# EAGLE design S4CX11 (EAGLE 7.5.0)
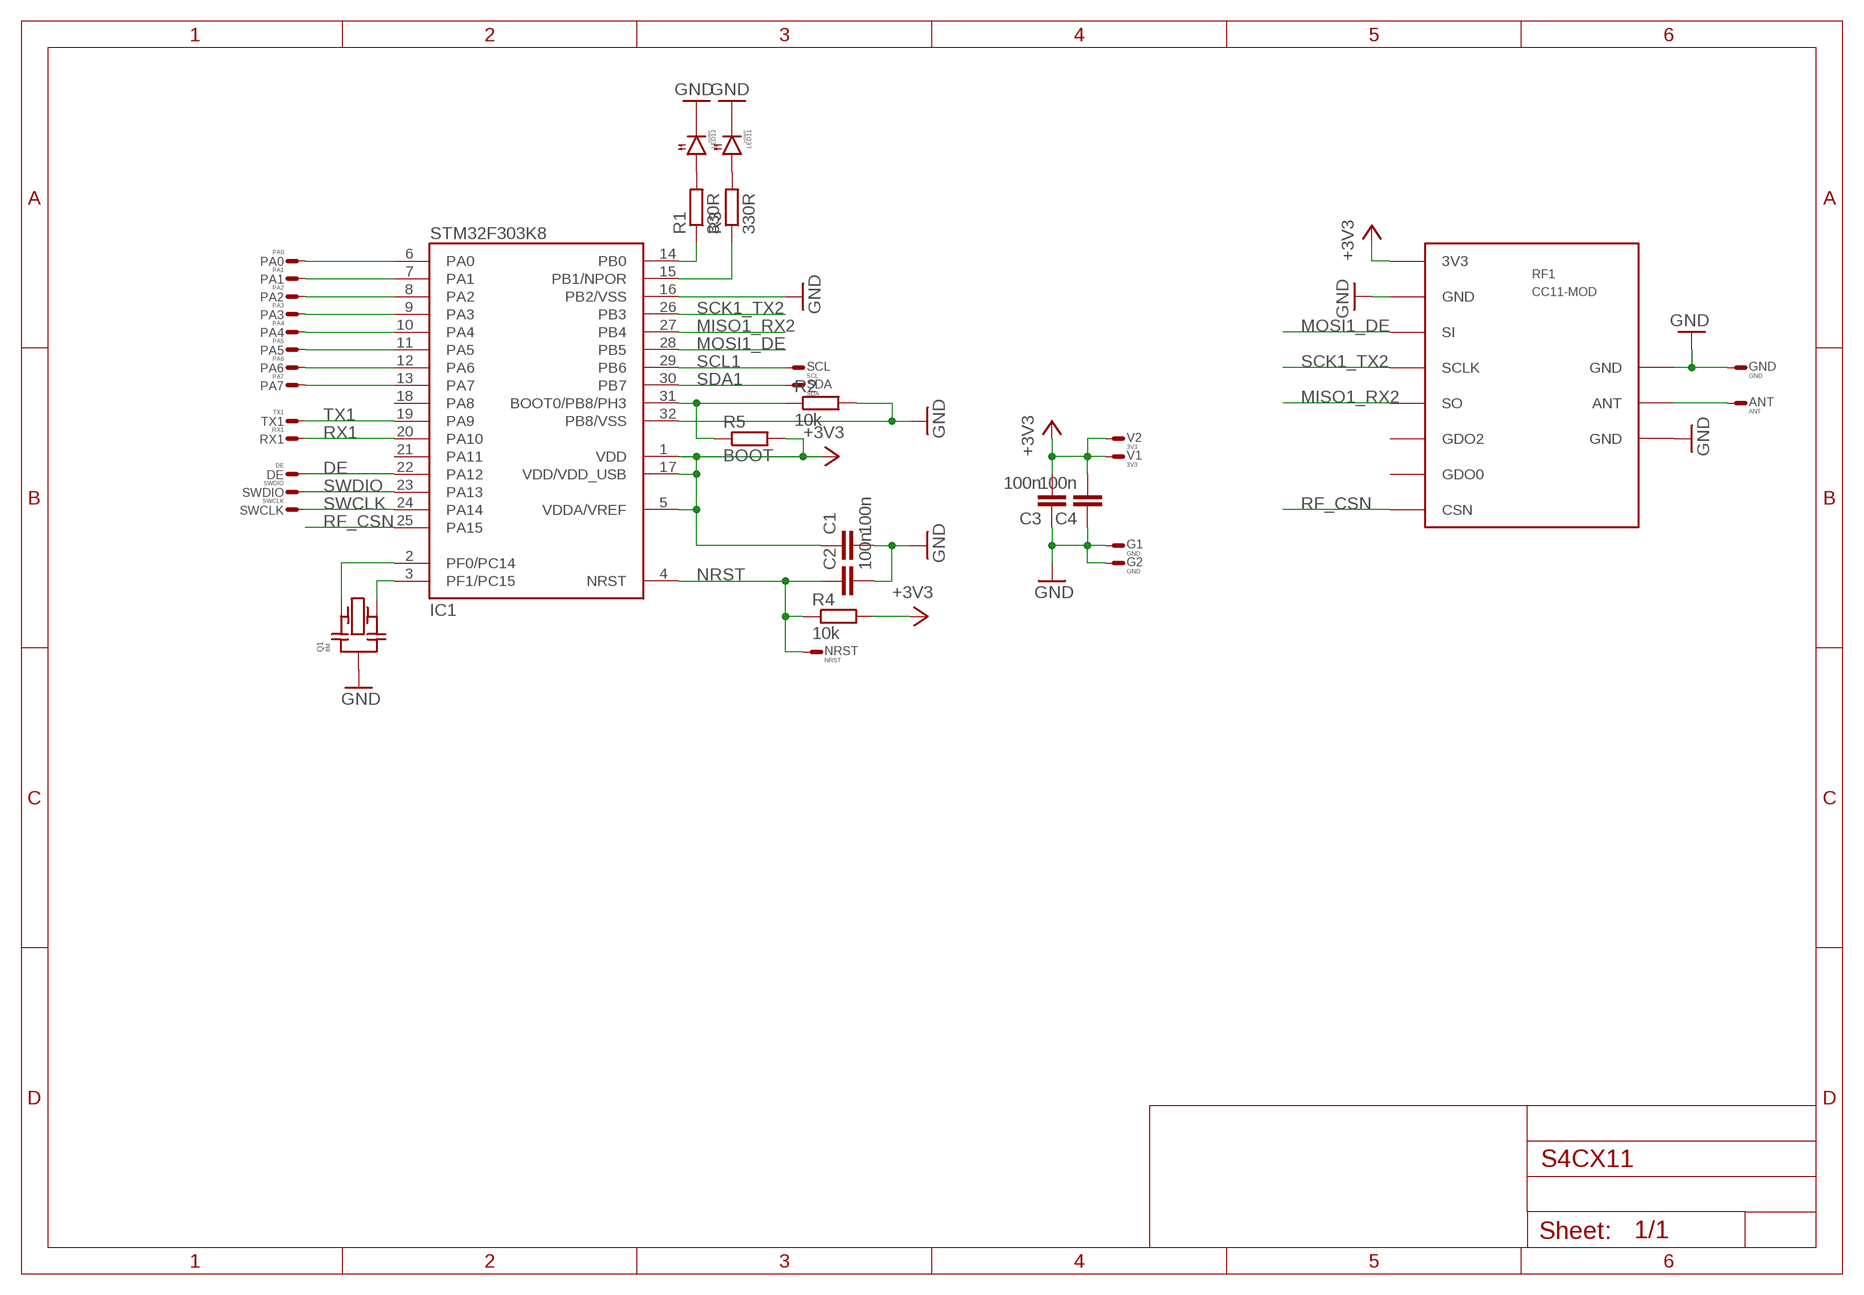
[diagram p0: schematic, sheet 1]

## Parts
ANT  ANT  WIREPADT1.6/0.9  [T1.6/0.9]
C1  100n  C0603  [0603]
C2  100n  C0603  [0603]
C3  100n  C0603  [0603]
C4  100n  C0603  [0603]
DE  DE  WIREPADT1.6/0.9  [T1.6/0.9]
G1  GND  WIREPADT1.6/0.9  [T1.6/0.9]
G2  GND  WIREPADT1.6/0.9  [T1.6/0.9]
GND  GND  WIREPADT1.6/0.9  [T1.6/0.9]
IC1  STM32F303K8  STM32_LQFP32  [LQFP32-7X7]
LED1  HSMF  2LEDH  [HSMF]
NRST  NRST  WIREPADT1.6/0.9  [T1.6/0.9]
PA0  PA0  WIREPADT1.6/0.9  [T1.6/0.9]
PA1  PA1  WIREPADT1.6/0.9  [T1.6/0.9]
PA2  PA2  WIREPADT1.6/0.9  [T1.6/0.9]
PA3  PA3  WIREPADT1.6/0.9  [T1.6/0.9]
PA4  PA4  WIREPADT1.6/0.9  [T1.6/0.9]
PA5  PA5  WIREPADT1.6/0.9  [T1.6/0.9]
PA6  PA6  WIREPADT1.6/0.9  [T1.6/0.9]
PA7  PA7  WIREPADT1.6/0.9  [T1.6/0.9]
Q1  8M  QRCE  [CSTCE]
R1  330R  R0603  [0603]
R2  10k  R0603  [0603]
R3  330R  R0603  [0603]
R4  10k  R0603  [0603]
R5  BOOT  R1206  [1206]
RF1  CC11-MOD  [CC11-MOD]
RX1  RX1  WIREPADT1.6/0.9  [T1.6/0.9]
SCL  SCL  WIREPADT1.6/0.9  [T1.6/0.9]
SDA  SDA  WIREPADT1.6/0.9  [T1.6/0.9]
SWCLK  SWCLK  WIREPADT1.6/0.9  [T1.6/0.9]
SWDIO  SWDIO  WIREPADT1.6/0.9  [T1.6/0.9]
TX1  TX1  WIREPADT1.6/0.9  [T1.6/0.9]
V1  3V3  WIREPADT1.6/0.9  [T1.6/0.9]
V2  3V3  WIREPADT1.6/0.9  [T1.6/0.9]

## Nets
+3V3: C1.1 C3.2 C4.2 IC1.1(VDD) IC1.5(VDDA/VREF) IC1.17(VDD/VDD_USB) R4.2 R5.2 RF1.3V3 V1.1(S) V2.1(S)
DE: DE.1(S) IC1.22(PA12)
GND: C1.2 C2.2 C3.1 C4.1 G1.1(S) G2.1(S) GND.1(S) IC1.16(PB2/VSS) IC1.32(PB8/VSS) LED1.2(1:C) LED1.4(2:C) Q1.G(M) R2.2 RF1.GND@1(GND) RF1.GND@2(GND) RF1.GND@3(GND)
MISO1_RX2: IC1.27(PB4) RF1.SO
MOSI1_DE: IC1.28(PB5) RF1.SI
N$1: ANT.1(S) RF1.ANT
N$2: IC1.3(PF1/PC15) Q1.B
N$3: IC1.6(PA0) PA0.1(S)
N$4: IC1.31(BOOT0/PB8/PH3) R2.1 R5.1
N$5: IC1.2(PF0/PC14) Q1.A
N$6: IC1.7(PA1) PA1.1(S)
N$7: IC1.8(PA2) PA2.1(S)
N$8: IC1.9(PA3) PA3.1(S)
N$9: IC1.10(PA4) PA4.1(S)
N$10: IC1.11(PA5) PA5.1(S)
N$11: IC1.12(PA6) PA6.1(S)
N$12: IC1.13(PA7) PA7.1(S)
N$13: IC1.14(PB0) R1.1
N$14: IC1.15(PB1/NPOR) R3.1
N$17: LED1.1(1:A) R3.2
N$18: LED1.3(2:A) R1.2
NRST: C2.1 IC1.4(NRST) NRST.1(S) R4.1
RF_CSN: IC1.25(PA15) RF1.CSN
RX1: IC1.20(PA10) RX1.1(S)
SCK1_TX2: IC1.26(PB3) RF1.SCLK
SCL1: IC1.29(PB6) SCL.1(S)
SDA1: IC1.30(PB7) SDA.1(S)
SWCLK: IC1.24(PA14) SWCLK.1(S)
SWDIO: IC1.23(PA13) SWDIO.1(S)
TX1: IC1.19(PA9) TX1.1(S)
Unconnected: IC1.18(PA8) IC1.21(PA11) RF1.GDO0 RF1.GDO2

## Library data of the parts
ANT DE G1 G2 GND NRST PA0 PA1-PA7 RX1 SCL SDA SWCLK SWDIO TX1 V1 V2 = Conn:WIREPAD: Wire PAD connect wire on PCB
C1-C4 = RCL:C: Capacitor SMD
IC1 = STM32:STM32_LQFP32
LED1 = Optic:2LED
Q1 = QUARTZ:QR
R1-R5 = RCL:R: Resistor SMD
RF1 = RF:CC11-MOD

## Board
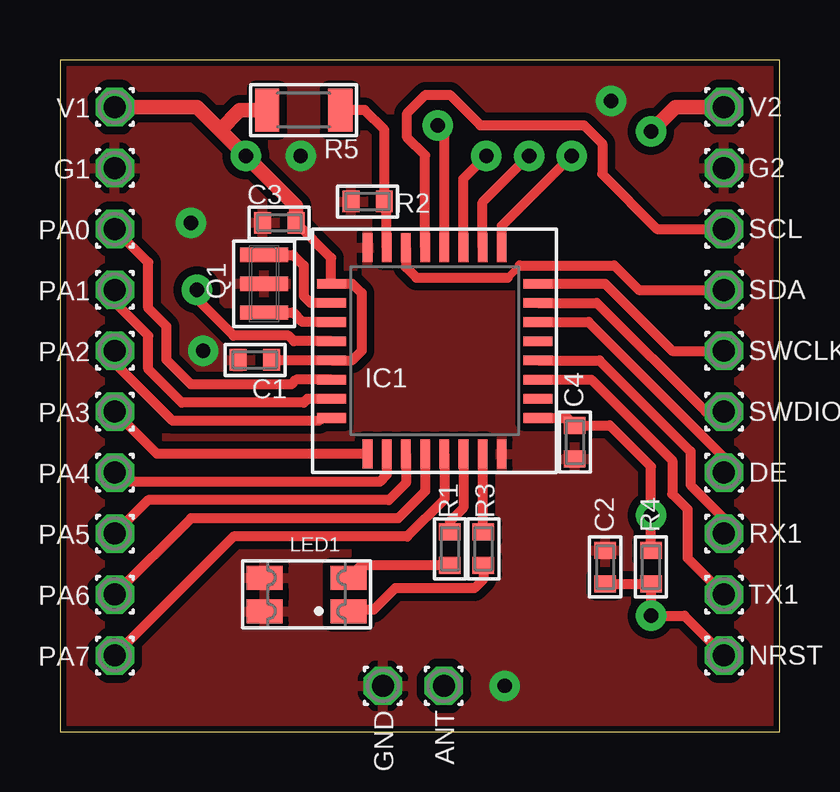
[diagram p1: board, top side]
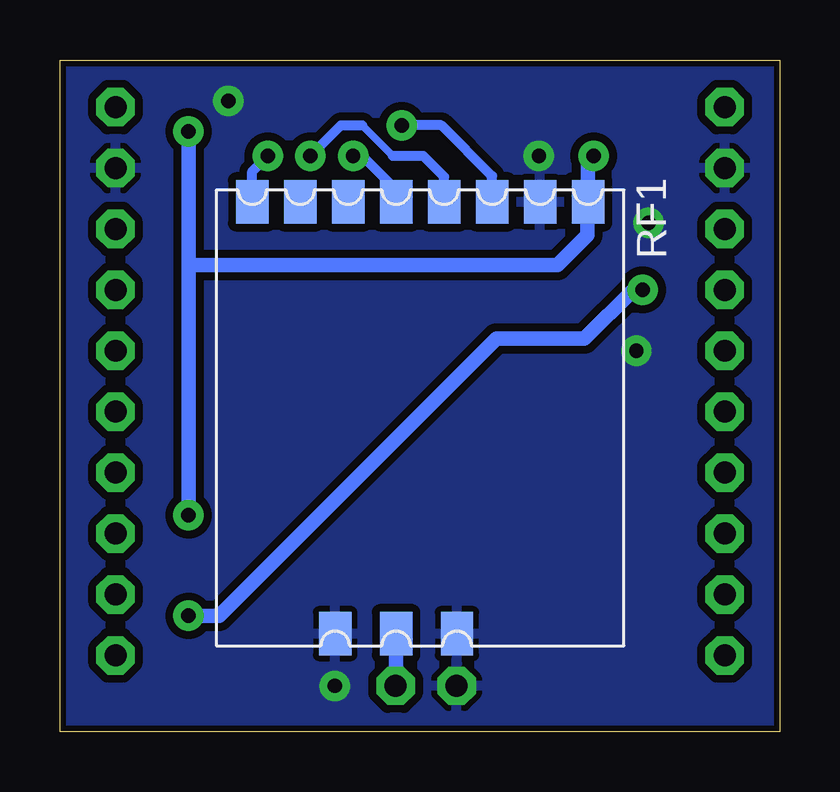
[diagram p2: board, bottom side, seen from below]

Size 30 x 28 mm. Coordinates in mm from the lower left corner, seen from the top.
Outline: 0,0 30,0 30,28 0,28 0,0
Copper layers (1*16): Top 0.035mm / dielectric 1.5mm / Bottom 0.035mm
Design rules "default *": minimum track width 12mil, minimum drill 12mil, track to track 13mil, track to pad 13mil, pad to pad 13mil, via to via 13mil, smd to smd 13mil, copper to edge 10mil, drill to drill 8mil, minimum pad ring 10mil, minimum via ring 8mil, stop-mask expansion 2mil, vias tented up to drill 0mil, thermal gap 10mil

### Footprints (pad centres in the part's own frame; a part is rotated, then mirrored left to right if it is on the bottom)
T1.6/0.9 = drill 0.914 pad 1.6 octagon: 1 0,0
0603 = smd 0.7 x 0.9: 1 -0.697,0; 2 0.697,0
LQFP32-7X7 = smd 1.2 x 0.4: 1 -4.3,2.8; 2 -4.3,2; 3 -4.3,1.2; 4 -4.3,0.4; 5 -4.3,-0.4; 6 -4.3,-1.2; 7 -4.3,-2; 8 -4.3,-2.8; 17 4.3,-2.8; 18 4.3,-2; 19 4.3,-1.2; 20 4.3,-0.4; 21 4.3,0.4; 22 4.3,1.2; 23 4.3,2; 24 4.3,2.8 | smd 0.4 x 1.2: 9 -2.8,-4.3; 10 -2,-4.3; 11 -1.2,-4.3; 12 -0.4,-4.3; 13 0.4,-4.3; 14 1.2,-4.3; 15 2,-4.3; 16 2.8,-4.3; 25 2.8,4.3; 26 2,4.3; 27 1.2,4.3; 28 0.4,4.3; 29 -0.4,4.3; 30 -1.2,4.3; 31 -2,4.3; 32 -2.8,4.3
HSMF = smd 1 x 1.5: 1 -0.7,-1.75; 2 -0.7,1.75; 3 0.7,-1.75; 4 0.7,1.75
CSTCE = smd 0.6 x 2: A -1.2,0; B 1.2,0; G 0,0
1206 = smd 1.016 x 1.778: 1 -1.524,0; 2 1.524,0
CC11-MOD = smd 1.8 x 1.35: 3V3 -9,7; ANT 9,-1; CSN -9,-7; GDO0 -9,-5; GDO2 -9,-3; GND@1 -9,5; GND@2 9,1.54; GND@3 9,-3.54; SCLK -9,1; SI -9,3; SO -9,-1

### Placement (x,y rotation side)
ANT  16,1.91 270 top
C1  8.13,15.49 180 top
C2  22.73,6.86 90 top
C3  9.14,21.21 0 top
C4  21.46,12.06 90 top
DE  27.69,10.79 0 top
G1  2.29,23.5 180 top
G2  27.69,23.5 0 top
GND  13.46,1.91 270 top
IC1  15.62,15.88 0 top
LED1  10.29,5.71 90 top
NRST  27.69,3.17 0 top
PA0  2.29,20.95 180 top
PA1  2.29,18.41 180 top
PA2  2.29,15.88 180 top
PA3  2.29,13.34 180 top
PA4  2.29,10.79 180 top
PA5  2.29,8.26 180 top
PA6  2.29,5.71 180 top
PA7  2.29,3.17 180 top
Q1  8.51,18.67 270 top
R1  16.26,7.62 270 top
R2  12.83,22.1 180 top
R3  17.65,7.62 270 top
R4  24.64,6.86 90 top
R5  10.16,25.91 180 top
RF1  14.99,13.08 270 bottom
RX1  27.69,8.26 0 top
SCL  27.69,20.95 0 top
SDA  27.69,18.41 0 top
SWCLK  27.69,15.88 0 top
SWDIO  27.69,13.34 0 top
TX1  27.69,5.71 0 top
V1  2.29,26.04 180 top
V2  27.69,26.04 0 top

### Tracks (layer width: path | path; a pad name or v marks a point on that pad's centre or on a via)
+3V3  (via drill 0.6 pad 1.27)
  Top 0.406: C1.1 8.84,15.47 IC1.5 12.17,15.47 12.57,15.88 12.57,18.29 12.19,18.68 IC1.1 11.32,18.78 11.3,18.8 11.3,19.75 C3.2 | IC1.17 21.15,13.07 C4.2 22.93,12.76 24.64,11.05 v24.64,9.02 R4.2
  Top 0.61: C3.2 9.84,21.91 v7.75,24 6.67,25.08 | V1.1 5.71,26.04 6.67,25.08 | V2.1 25.65,26.04 v24.64,25.02 | R5.2 7.49,25.91 6.67,25.08
  Bottom 0.61: 24.64,19.45 9.26,19.45 8,20.7 8,22.07 RF1.3V3 7.99,23.76 v7.75,24 | 24.64,19.45 v24.64,9.02 | v24.64,25.02 24.64,19.45
DE
  Top 0.406: DE.1 27.69,11.43 22.04,17.07 IC1.22
GND  (via drill 0.6 pad 1.27)
  other vias: 10.03,24 5.46,21.21 5.97,15.88 18.54,1.91 22.99,26.29
  pour Top: 0,0 30,0 30,28 0,28
  pour Bottom: 0,0 30,0 30,28 0,28
MISO1_RX2  (via drill 0.6 pad 1.27)
  Top 0.406: IC1.27 16.82,23.04 v17.78,24
  Bottom 0.406: RF1.SO 15.99,22.59 17.4,24 v17.78,24
MOSI1_DE  (via drill 0.6 pad 1.27)
  Top 0.406: IC1.28 16.02,25 v15.75,25.27
  Bottom 0.406: RF1.SI 11.99,23.16 14.1,25.27 v15.75,25.27
N$1
  Bottom 0.61: ANT.1 15.99,1.91 RF1.ANT
N$2
  Top 0.406: IC1.3 10.1,17.07 9.71,17.47 Q1.B
N$3
  Top 0.406: IC1.6 9.85,14.68 9.65,14.48 5.46,14.48 4.45,15.49 4.45,16.89 3.68,17.65 3.68,19.56 PA0.1
N$4
  Top 0.406: IC1.31 13.62,22 R2.1 13.52,25.08 12.7,25.91 R5.1
N$5
  Top 0.406: Q1.A 9.72,19.87 10.16,19.43 10.16,18.16 10.45,17.88 IC1.2
N$6
  Top 0.406: IC1.7 10.32,13.88 10.16,13.72 5.08,13.72 3.68,15.11 3.68,16.51 2.29,17.91 PA1.1
N$7
  Top 0.406: IC1.8 10.92,13.07 10.79,12.95 4.7,12.95 2.29,15.37 PA2.1
N$8
  Top 0.406: IC1.9 4.05,11.57 PA3.1
N$9
  Top 0.406: IC1.10 13.62,10.7 13.34,10.41 2.67,10.41 PA4.1
N$10
  Top 0.406: IC1.11 14.42,10.36 13.72,9.65 3.68,9.65 PA5.1
N$11
  Top 0.406: IC1.12 15.22,10.01 14.1,8.89 5.46,8.89 PA6.1
N$12
  Top 0.406: IC1.13 16.02,9.67 14.48,8.13 7.24,8.13 PA7.1
N$13
  Top 0.406: IC1.14 16.82,9.33 16.26,8.76 R1.1
N$14
  Top 0.406: IC1.15 17.62,8.35 R3.1
N$17
  Top 0.406: R3.2 17.65,6.35 17.27,5.97 13.97,5.97 13.08,5.08 12.1,5.08 LED1.1
N$18
  Top 0.406: R1.2 12.54,6.92 LED1.3
NRST  (via drill 0.6 pad 1.27)
  Top 0.406: IC1.4 9.76,16.27 9.53,16.51 7.24,16.51 5.71,18.03 v5.71,18.41 | C2.1 R4.1 v24.64,4.83 26.04,4.83 NRST.1
  Bottom 0.61: v5.71,18.41 6.1,18.41 8.13,16.38 11.81,16.38 23.37,4.83 v24.64,4.83
RF_CSN  (via drill 0.6 pad 1.27)
  Top 0.406: IC1.25 18.42,21.09 v21.34,24
  Bottom 0.406: RF1.CSN 21.99,23.35 v21.34,24
RX1
  Top 0.406: IC1.20 22.5,15.47 26.29,11.68 26.29,10.29 27.69,8.89 RX1.1
SCK1_TX2  (via drill 0.6 pad 1.27)
  Top 0.406: IC1.26 17.62,22.07 v19.56,24
  Bottom 0.305: 17.4,25.27 16.13,24
  Bottom 0.406: v19.56,24 18.29,25.27 17.4,25.27 | 16.13,24 14.86,24 13.99,23.13 RF1.SCLK
SCL1
  Top 0.406: IC1.29 15.22,24.02 14.48,24.77 14.48,25.78 15.24,26.54 16.26,26.54 17.53,25.27 21.84,25.27 22.61,24.51 22.61,23.24 24.89,20.95 SCL.1
SDA1
  Top 0.305: 18.67,18.92 19.18,19.43
  Top 0.406: IC1.30 14.42,19.36 14.86,18.92 18.67,18.92 | 19.18,19.43 23.11,19.43 24.13,18.41 SDA.1
SWCLK
  Top 0.406: IC1.24 22.73,18.68 25.53,15.88 SWCLK.1
SWDIO
  Top 0.406: IC1.23 22.38,17.88 26.92,13.34 SWDIO.1
TX1
  Top 0.406: IC1.19 22.16,14.68 25.53,11.3 25.53,9.91 26.16,9.27 26.16,7.24 TX1.1